# EAGLE schematic ESP8266_InlinePSU (EAGLE 8.4.3)
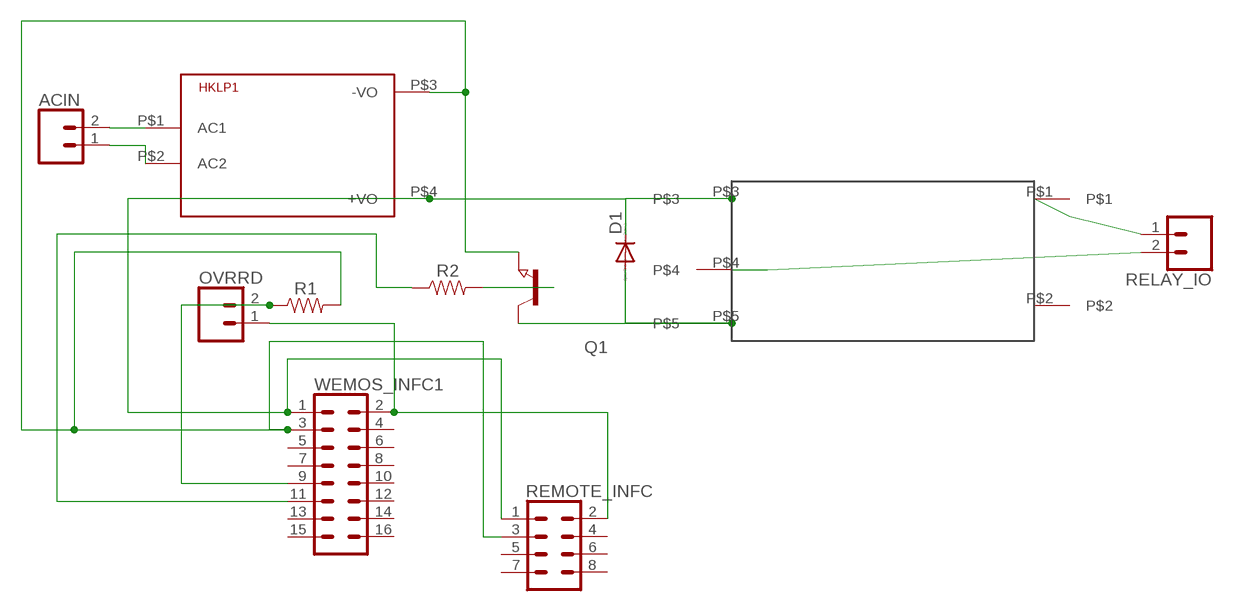
[diagram p0: schematic, sheet 1]

## Parts
ACIN  CONN_025MM  [SCREWTERMINAL-5MM-2]
D1  1N4148DO35-7  [DO35-7]
HKLP1  HKLPM01  [HKLPM01]
OVRRD  CONN_02LOCK  [1X02_LOCK]
Q1  NPN-TRANSISTOR_SOT23  [SOT23]
R1  RESISTOR0805  [0805]
R2  RESISTOR0805  [0805]
RELAY_IO  CONN_025MM  [SCREWTERMINAL-5MM-2]
REMOTE_INFC  CONN_04X2  [2X4]
U$1  SRD-05VDC-SL-CTH  [SRD-05VDC-SL-C]
WEMOS_INFC1  CONN_08X2  [2X8]

## Nets
N$1: ACIN.2 HKLP1.P$1(AC1)
N$2: ACIN.1 HKLP1.P$2(AC2)
N$3: D1.C HKLP1.P$4(+VO) REMOTE_INFC.1 U$1.P$3 WEMOS_INFC1.1
N$4: OVRRD.1 REMOTE_INFC.2 WEMOS_INFC1.2
N$5: HKLP1.P$3(-VO) Q1.2(E) R1.2 REMOTE_INFC.3 WEMOS_INFC1.3
N$6: RELAY_IO.1 U$1.P$1
N$7: RELAY_IO.2 U$1.P$4
N$8: D1.A Q1.3(C) U$1.P$5
N$9: OVRRD.2 R1.1 WEMOS_INFC1.9
N$10: Q1.1(B) R2.2
N$11: R2.1 WEMOS_INFC1.11
Unconnected: REMOTE_INFC.4 REMOTE_INFC.5 REMOTE_INFC.6 REMOTE_INFC.7 REMOTE_INFC.8 U$1.P$2 WEMOS_INFC1.4 WEMOS_INFC1.5 WEMOS_INFC1.6 WEMOS_INFC1.7 WEMOS_INFC1.8 WEMOS_INFC1.10 WEMOS_INFC1.12 WEMOS_INFC1.13 WEMOS_INFC1.14 WEMOS_INFC1.15 WEMOS_INFC1.16

## Library data of the parts
ACIN RELAY_IO = SparkFun-Connectors:CONN_02: Multi connection point. Often used as Generic Header-pin footprint for 0.1 inch spaced/style header connections On any of the 0.1 inch spaced packages, you can populate with these: Break Away Headers - Straight <https://www.sparkfun.com/products/116> (PRT-00116) Break Away Male Headers - Right Angle <https://www.sparkfun.com/products/553> (PRT-00553) Female Headers <https://www.sparkfun.com/products/115> (PRT-00115) Break Away Headers - Machine Pin <https://www.sparkfun.com/products/117> (PRT-00117) Break Away Female Headers - Swiss Machine Pin <https://www.sparkfun.com/products/743> (PRT-00743) For SCREWTERMINALS and SPRING TERMINALS visit here: Screw Terimnals on SparkFun.com <https://www.sparkfun.com/search/results?term=Screw+Terminals> (5mm/3.5mm/2.54mm spacing) This device is also useful as a general connection point to wire up your design to another part of your project. Our various solder wires solder well into these plated through hole pads. Hook-Up Wire - Assortment (Stranded, 22 AWG) <https://www.sparkfun.com/products/11375> (PRT-11375) Hook-Up Wire - Assortment (Solid Core, 22 AWG) <https://www.sparkfun.com/products/11367> (PRT-11367) View the entire wire category on our website here <https://www.sparkfun.com/categories/141> Special notes: Molex polarized connector foot print use with: PRT-08233 with associated crimp pins and housings. 2.54_SCREWTERM for use with PRT-10571. 3.5mm Screw Terminal footprints for PRT-08084 5mm Screw Terminal footprints for use with PRT-08432; SF_SKU: PRT-08432
D1 = diode:1N4148: DIODE high speed (Philips)
HKLP1 = bl_components:HKLPM01: 125-250vAC to 5vDC power converter with OCP OVP OTP
OVRRD = SparkFun-Connectors:CONN_02: Multi connection point. Often used as Generic Header-pin footprint for 0.1 inch spaced/style header connections On any of the 0.1 inch spaced packages, you can populate with these: Break Away Headers - Straight <https://www.sparkfun.com/products/116> (PRT-00116) Break Away Male Headers - Right Angle <https://www.sparkfun.com/products/553> (PRT-00553) Female Headers <https://www.sparkfun.com/products/115> (PRT-00115) Break Away Headers - Machine Pin <https://www.sparkfun.com/products/117> (PRT-00117) Break Away Female Headers - Swiss Machine Pin <https://www.sparkfun.com/products/743> (PRT-00743) For SCREWTERMINALS and SPRING TERMINALS visit here: Screw Terimnals on SparkFun.com <https://www.sparkfun.com/search/results?term=Screw+Terminals> (5mm/3.5mm/2.54mm spacing) This device is also useful as a general connection point to wire up your design to another part of your project. Our various solder wires solder well into these plated through hole pads. Hook-Up Wire - Assortment (Stranded, 22 AWG) <https://www.sparkfun.com/products/11375> (PRT-11375) Hook-Up Wire - Assortment (Solid Core, 22 AWG) <https://www.sparkfun.com/products/11367> (PRT-11367) View the entire wire category on our website here <https://www.sparkfun.com/categories/141> Special notes: Molex polarized connector foot print use with: PRT-08233 with associated crimp pins and housings. 2.54_SCREWTERM for use with PRT-10571. 3.5mm Screw Terminal footprints for PRT-08084 5mm Screw Terminal footprints for use with PRT-08432
Q1 = semicon-smd-ipc:NPN-TRANSISTOR_: NPN TRANSISTOR
R1 R2 = SparkFun-Resistors:RESISTOR: Generic Resistor Package
REMOTE_INFC = SparkFun-Connectors:CONN_04X2: Multi connection point. Often used as Generic Header-pin footprint for 0.1 inch spaced/style header connections On any of the 0.1 inch spaced packages, you can populate with these: Break Away Headers - Straight <https://www.sparkfun.com/products/116> (PRT-00116) Break Away Male Headers - Right Angle <https://www.sparkfun.com/products/553> (PRT-00553) Female Headers <https://www.sparkfun.com/products/115> (PRT-00115) Break Away Headers - Machine Pin <https://www.sparkfun.com/products/117> (PRT-00117) Break Away Female Headers - Swiss Machine Pin <https://www.sparkfun.com/products/743> (PRT-00743)
U$1 = bl_components:SRD-05VDC-SL-C
WEMOS_INFC1 = SparkFun-Connectors:CONN_08X2: Multi connection point. Often used as Generic Header-pin footprint for 0.1 inch spaced/style header connections You can populate with any combo of single row headers, but if you'd like an exact match, check this: Header - 2x8 (Male, 0.1") <https://www.sparkfun.com/products/13156> (PRT-13156) On any of the 0.1 inch spaced packages, you can populate with these: Break Away Headers - Straight <https://www.sparkfun.com/products/116> (PRT-00116) Break Away Male Headers - Right Angle <https://www.sparkfun.com/products/553> (PRT-00553) Female Headers <https://www.sparkfun.com/products/115> (PRT-00115) Break Away Headers - Machine Pin <https://www.sparkfun.com/products/117> (PRT-00117) Break Away Female Headers - Swiss Machine Pin <https://www.sparkfun.com/products/743> (PRT-00743)